# EAGLE schematic pm3-16 (EAGLE 7.4.0)

## Sheet 1 of 5
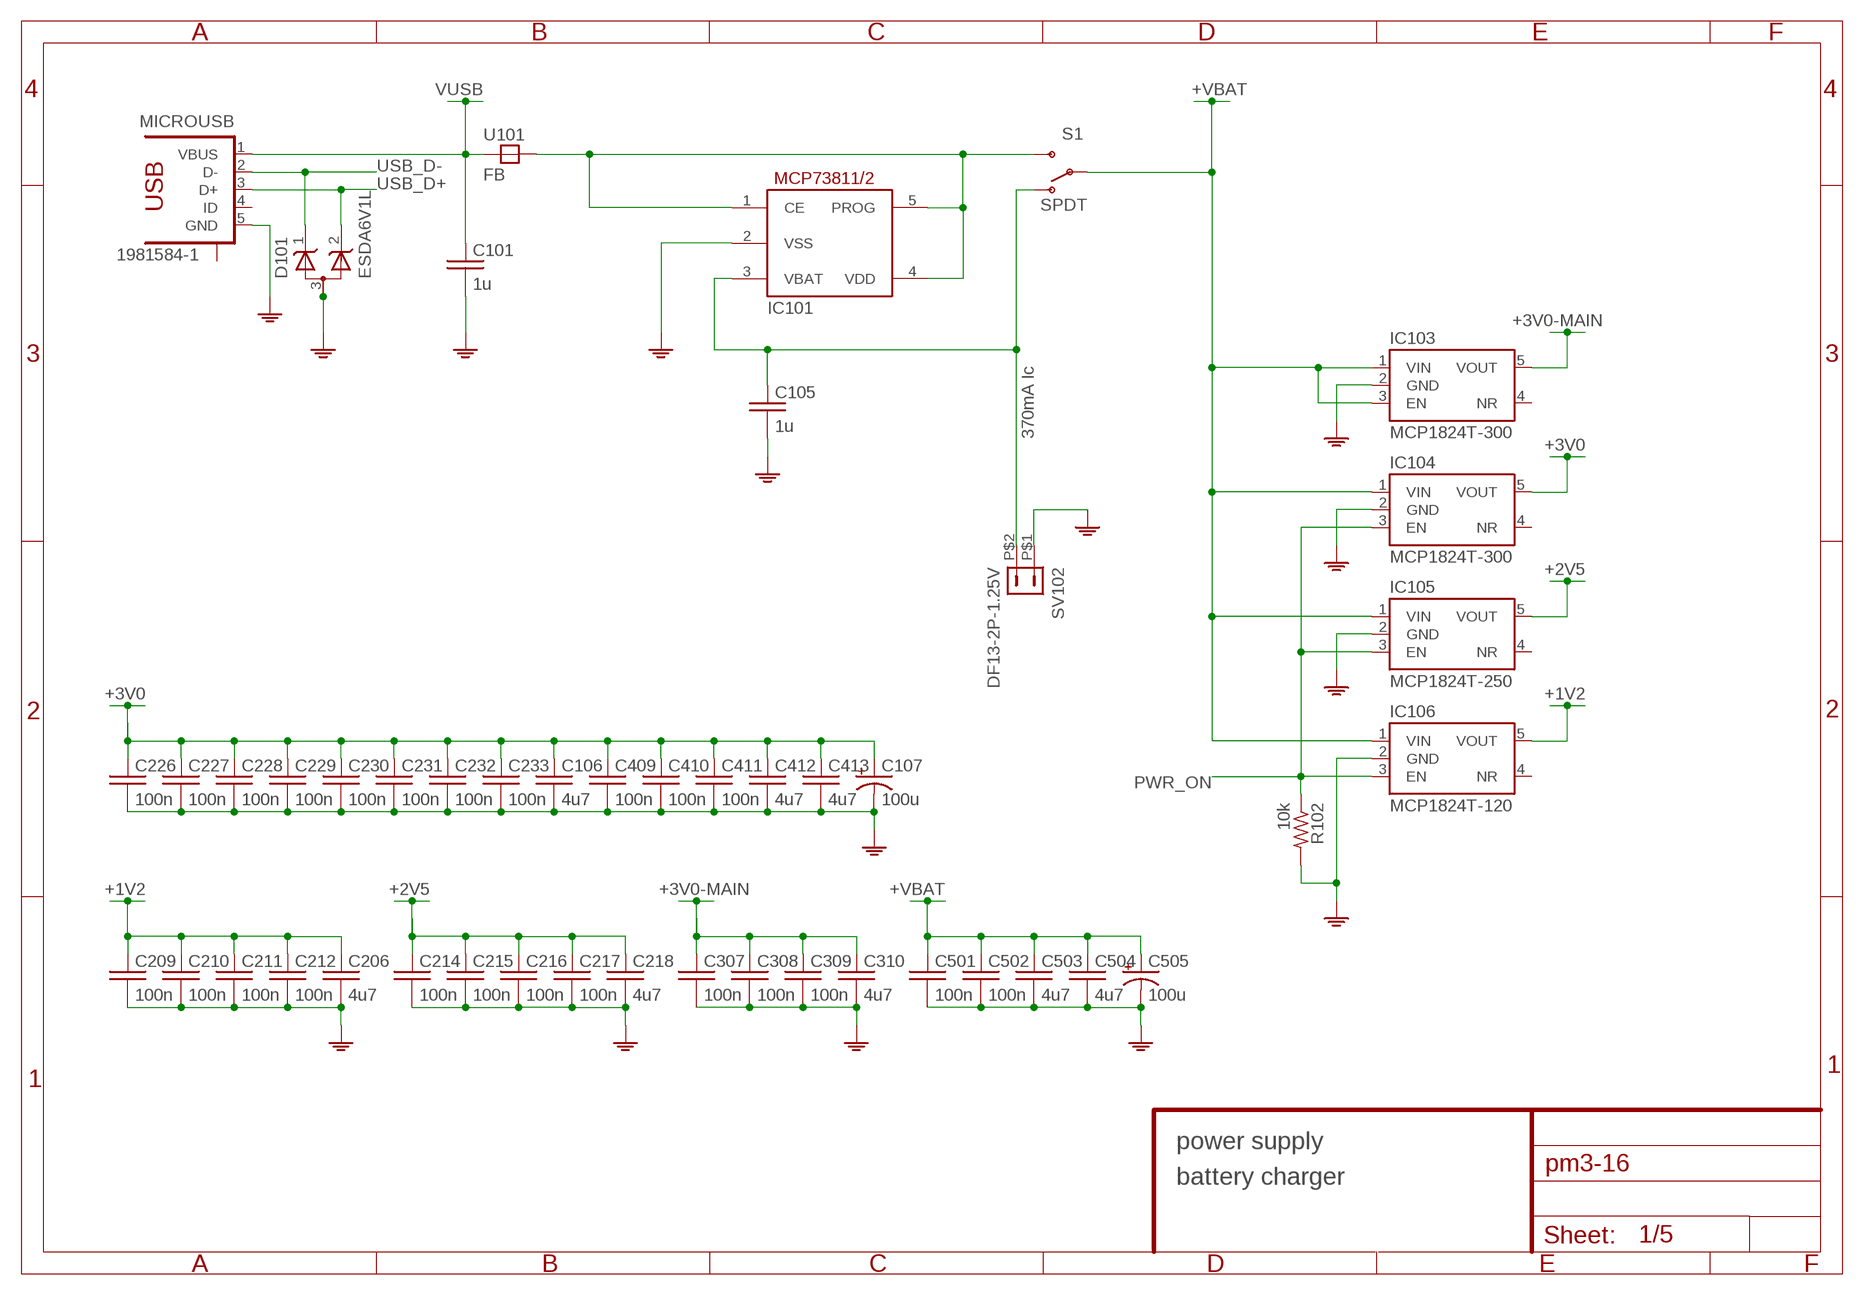
[diagram p0: schematic, sheet 1]

### Parts
C101  1u  C-EU  [0603]
C105  1u  C-EU  [0603]
C106  4u7  C-EU  [0603]
C107  100u  CPOL-US  [153CLV-0605]
C206  4u7  C-EU  [0603]
C209  100n  C-EU  [0603]
C210  100n  C-EU  [0603]
C211  100n  C-EU  [0603]
C212  100n  C-EU  [0603]
C214  100n  C-EU  [0603]
C215  100n  C-EU  [0603]
C216  100n  C-EU  [0603]
C217  100n  C-EU  [0603]
C218  4u7  C-EU  [0603]
C226  100n  C-EU  [0603]
C227  100n  C-EU  [0603]
C228  100n  C-EU  [0603]
C229  100n  C-EU  [0603]
C230  100n  C-EU  [0603]
C231  100n  C-EU  [0603]
C232  100n  C-EU  [0603]
C233  100n  C-EU  [0603]
C307  100n  C-EU  [0603]
C308  100n  C-EU  [0603]
C309  100n  C-EU  [0603]
C310  4u7  C-EU  [0603]
C409  100n  C-EU  [0603]
C410  100n  C-EU  [0603]
C411  100n  C-EU  [0603]
C412  4u7  C-EU  [0603]
C413  4u7  C-EU  [0603]
C501  100n  C-EU  [0603]
C502  100n  C-EU  [0603]
C503  4u7  C-EU  [0603]
C504  4u7  C-EU  [0603]
C505  100u  CPOL-US  [153CLV-0605]
D101  ESDA6V1L  [SOT-23-3]
IC101  MCP73811/2  [SOT23-5L]
IC103  MCP1824T-300  TPS79930  [SOT-23-5]
IC104  MCP1824T-300  TPS79930  [SOT-23-5]
IC105  MCP1824T-250  TPS79925  [SOT-23-5]
IC106  MCP1824T-120  TPS79912  [SOT-23-5]
MICROUSB  1981584-1  [1981584-1]
R102  10k  R-US  [0603]
S1  SPDT  SWITCH-SPSTSMD2  [SWITCH-SPDT-SMD]
SV102  DF13-2P-1.25V  [DF13C-2P-1.25V]
U101  FB  [0805]

### Nets
+1V2: C206.1 C209.1 C210.1 C211.1 C212.1 IC106.5(VOUT) ; also sheet 2
+2V5: C214.1 C215.1 C216.1 C217.1 C218.1 IC105.5(VOUT) ; also sheet 2
+3V0: C106.1 C107.+ C226.1 C227.1 C228.1 C229.1 C230.1 C231.1 C232.1 C233.1 C409.1 C410.1 C411.1 C412.1 C413.1 IC104.5(VOUT) ; also sheet 2,3,4
+3V0-MAIN: C307.1 C308.1 C309.1 C310.1 IC103.5(VOUT) ; also sheet 3
+VBAT: C501.1 C502.1 C503.1 C504.1 C505.+ IC103.1(VIN) IC103.3(EN) IC104.1(VIN) IC105.1(VIN) IC106.1(VIN) S1.2(P) ; also sheet 3,5
BAT: C105.1 IC101.3(VBAT) S1.1(O) SV102.P$2
GND: C101.2 C105.2 C106.2 C107.- C206.2 C209.2 C210.2 C211.2 C212.2 C214.2 C215.2 C216.2 C217.2 C218.2 C226.2 C227.2 C228.2 C229.2 C230.2 C231.2 C232.2 C233.2 C307.2 C308.2 C309.2 C310.2 C409.2 C410.2 C411.2 C412.2 C413.2 C501.2 C502.2 C503.2 C504.2 C505.- D101.3(AA) IC101.2(VSS) IC103.2(GND) IC104.2(GND) IC105.2(GND) IC106.2(GND) MICROUSB.5(GND) R102.2 SV102.P$1 ; supply symbol labelled AGND ; also sheet 2,3,4,5
N$18: IC101.1(CE) IC101.4(VDD) IC101.5(PROG) S1.3(S) U101.2(B)
PWR_ON: IC104.3(EN) IC105.3(EN) IC106.3(EN) R102.1 ; also sheet 3
USB_D+: D101.2(K2) MICROUSB.3(D+) ; also sheet 3
USB_D-: D101.1(K1) MICROUSB.2(D-) ; also sheet 3
VUSB: C101.1 MICROUSB.1(VBUS) U101.1(A)
Unconnected: IC103.4(NR) IC104.4(NR) IC105.4(NR) IC106.4(NR) MICROUSB.4(ID) MICROUSB.S1 MICROUSB.S2 MICROUSB.S3 MICROUSB.S4

### Notes on the sheet
- 370mA Ic
- power supply
- battery charger

## Sheet 2 of 5
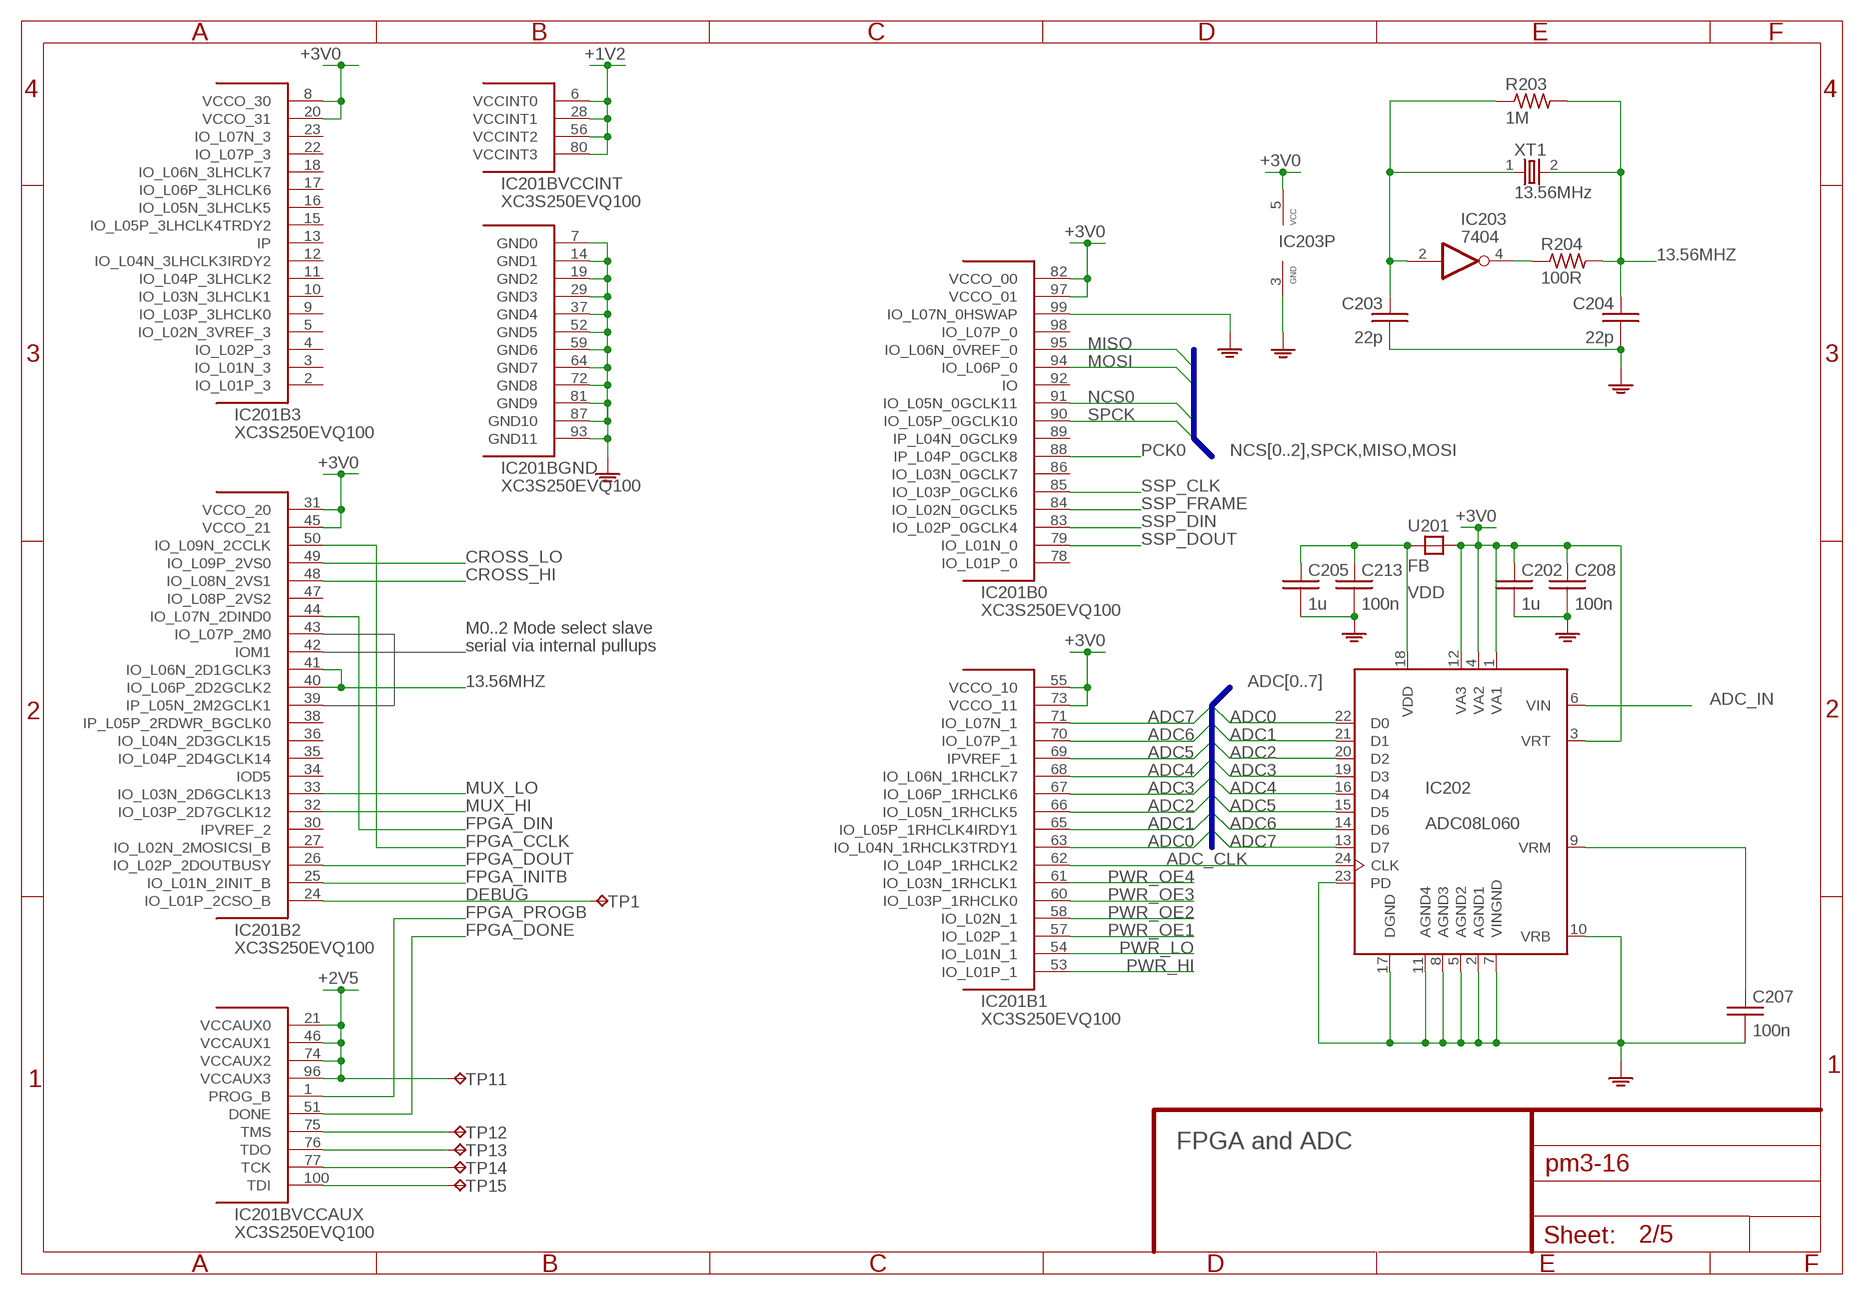
[diagram p1: schematic, sheet 2]

### Parts
C202  1u  C-EU  [0603]
C203  22p  C-EU  [0603]
C204  22p  C-EU  [0603]
C205  1u  C-EU  [0603]
C207  100n  C-EU  [0603]
C208  100n  C-EU  [0603]
C213  100n  C-EU  [0603]
IC201  XC3S250EVQ100  [VQ100]
IC202  ADC08L060  ADC08060  [TSSOP24]
IC203  7404  [SOT-23-5]
R203  1M  R-US  [0603]
R204  100R  R-US  [0603]
TP1  TPTP06SQ  [TP06SQ]
TP11  TPTP06SQ  [TP06SQ]
TP12  TPTP06SQ  [TP06SQ]
TP13  TPTP06SQ  [TP06SQ]
TP14  TPTP06SQ  [TP06SQ]
TP15  TPTP06SQ  [TP06SQ]
U201  FB  [0805]
XT1  13.56MHz  XTAL  [6035]

### Nets
13.56MHZ: C204.1 IC201.40(B2:IO_L06P_2D2GCLK2) IC201.41(B2:IO_L06N_2D1GCLK3) R203.2 R204.2 XT1.2(G$2)
+1V2: IC201.6(BVCCINT:VCCINT0) IC201.28(BVCCINT:VCCINT1) IC201.56(BVCCINT:VCCINT2) IC201.80(BVCCINT:VCCINT3) ; also sheet 1
+2V5: IC201.21(BVCCAUX:VCCAUX0) IC201.46(BVCCAUX:VCCAUX1) IC201.74(BVCCAUX:VCCAUX2) IC201.96(BVCCAUX:VCCAUX3) TP11.TP ; also sheet 1
+3V0: C202.1 C208.1 IC201.8(B3:VCCO_30) IC201.20(B3:VCCO_31) IC201.31(B2:VCCO_20) IC201.45(B2:VCCO_21) IC201.55(B1:VCCO_10) IC201.73(B1:VCCO_11) IC201.82(B0:VCCO_00) IC201.97(B0:VCCO_01) IC202.1(VA1) IC202.3(VRT) IC202.4(VA2) IC202.12(VA3) IC203.5(VCC) U201.2(B) ; also sheet 1,3,4
ADC0: IC201.63(B1:IO_L04N_1RHCLK3TRDY1) IC202.22(D0)
ADC1: IC201.65(B1:IO_L05P_1RHCLK4IRDY1) IC202.21(D1)
ADC2: IC201.66(B1:IO_L05N_1RHCLK5) IC202.20(D2)
ADC3: IC201.67(B1:IO_L06P_1RHCLK6) IC202.19(D3)
ADC4: IC201.68(B1:IO_L06N_1RHCLK7) IC202.16(D4)
ADC5: IC201.69(B1:IPVREF_1) IC202.15(D5)
ADC6: IC201.70(B1:IO_L07P_1) IC202.14(D6)
ADC7: IC201.71(B1:IO_L07N_1) IC202.13(D7)
ADC_CLK: IC201.62(B1:IO_L04P_1RHCLK2) IC202.24(CLK)
ADC_IN: IC202.6(VIN) ; also sheet 4
CROSS_HI: IC201.48(B2:IO_L08N_2VS1) ; also sheet 4
CROSS_LO: IC201.49(B2:IO_L09P_2VS0) ; also sheet 4
DEBUG: IC201.24(B2:IO_L01P_2CSO_B) TP1.TP
FPGA_CCLK: IC201.50(B2:IO_L09N_2CCLK) ; also sheet 3
FPGA_DIN: IC201.44(B2:IO_L07N_2DIND0) ; also sheet 3
FPGA_DONE: IC201.51(BVCCAUX:DONE) ; also sheet 3
FPGA_DOUT: IC201.26(B2:IO_L02P_2DOUTBUSY) ; also sheet 3
FPGA_INITB: IC201.25(B2:IO_L01N_2INIT_B) ; also sheet 3
FPGA_PROGB: IC201.1(BVCCAUX:PROG_B) ; also sheet 3
FPGA_TCK: IC201.77(BVCCAUX:TCK) TP14.TP
FPGA_TDI: IC201.100(BVCCAUX:TDI) TP15.TP
FPGA_TDO: IC201.76(BVCCAUX:TDO) TP13.TP
FPGA_TMS: IC201.75(BVCCAUX:TMS) TP12.TP
GND: C202.2 C203.2 C204.2 C205.2 C207.2 C208.2 C213.2 IC201.7(BGND:GND0) IC201.14(BGND:GND1) IC201.19(BGND:GND2) IC201.29(BGND:GND3) IC201.37(BGND:GND4) IC201.52(BGND:GND5) IC201.59(BGND:GND6) IC201.64(BGND:GND7) IC201.72(BGND:GND8) IC201.81(BGND:GND9) IC201.87(BGND:GND10) IC201.93(BGND:GND11) IC201.99(B0:IO_L07N_0HSWAP) IC202.2(AGND1) IC202.5(AGND2) IC202.7(VINGND) IC202.8(AGND3) IC202.10(VRB) IC202.11(AGND4) IC202.17(DGND) IC202.23(PD) IC203.3(GND) ; supply symbol labelled AGND ; also sheet 1,3,4,5
MISO: IC201.95(B0:IO_L06N_0VREF_0) ; also sheet 3
MOSI: IC201.94(B0:IO_L06P_0) ; also sheet 3
MUX_HI: IC201.32(B2:IO_L03P_2D7GCLK12) ; also sheet 4
MUX_LO: IC201.33(B2:IO_L03N_2D6GCLK13) ; also sheet 4
N$1: C207.1 IC202.9(VRM)
N$3: IC203.4(O) R204.1
N$4: C203.1 IC203.2(I) R203.1 XT1.1(G$1)
NCS0: IC201.91(B0:IO_L05N_0GCLK11) ; also sheet 3
PCK0: IC201.88(B0:IP_L04P_0GCLK8) ; also sheet 3
PWR_HI: IC201.53(B1:IO_L01P_1) ; also sheet 5
PWR_LO: IC201.54(B1:IO_L01N_1) ; also sheet 5
PWR_OE1: IC201.57(B1:IO_L02P_1) ; also sheet 5
PWR_OE2: IC201.58(B1:IO_L02N_1) ; also sheet 5
PWR_OE3: IC201.60(B1:IO_L03P_1RHCLK0) ; also sheet 5
PWR_OE4: IC201.61(B1:IO_L03N_1RHCLK1) ; also sheet 5
SPCK: IC201.90(B0:IO_L05P_0GCLK10) ; also sheet 3
SSP_CLK: IC201.85(B0:IO_L03P_0GCLK6) ; also sheet 3
SSP_DIN: IC201.83(B0:IO_L02P_0GCLK4) ; also sheet 3
SSP_DOUT: IC201.79(B0:IO_L01N_0) ; also sheet 3
SSP_FRAME: IC201.84(B0:IO_L02N_0GCLK5) ; also sheet 3
VDD: C205.1 C213.1 IC202.18(VDD) U201.1(A)
Unconnected: IC201.2(B3:IO_L01P_3) IC201.3(B3:IO_L01N_3) IC201.4(B3:IO_L02P_3) IC201.5(B3:IO_L02N_3VREF_3) IC201.9(B3:IO_L03P_3LHCLK0) IC201.10(B3:IO_L03N_3LHCLK1) IC201.11(B3:IO_L04P_3LHCLK2) IC201.12(B3:IO_L04N_3LHCLK3IRDY2) IC201.13(B3:IP) IC201.15(B3:IO_L05P_3LHCLK4TRDY2) IC201.16(B3:IO_L05N_3LHCLK5) IC201.17(B3:IO_L06P_3LHCLK6) IC201.18(B3:IO_L06N_3LHCLK7) IC201.22(B3:IO_L07P_3) IC201.23(B3:IO_L07N_3) IC201.27(B2:IO_L02N_2MOSICSI_B) IC201.30(B2:IPVREF_2) IC201.34(B2:IOD5) IC201.35(B2:IO_L04P_2D4GCLK14) IC201.36(B2:IO_L04N_2D3GCLK15) IC201.38(B2:IP_L05P_2RDWR_BGCLK0) IC201.39(B2:IP_L05N_2M2GCLK1) IC201.42(B2:IOM1) IC201.43(B2:IO_L07P_2M0) IC201.47(B2:IO_L08P_2VS2) IC201.78(B0:IO_L01P_0) IC201.86(B0:IO_L03N_0GCLK7) IC201.89(B0:IP_L04N_0GCLK9) IC201.92(B0:IO) IC201.98(B0:IO_L07P_0)

### Buses
NCS[0..2],SPCK,MISO,MOSI
ADC[0..7]

### Notes on the sheet
- M0..2 Mode select slave
- serial via internal pullups
- FPGA and ADC

## Sheet 3 of 5
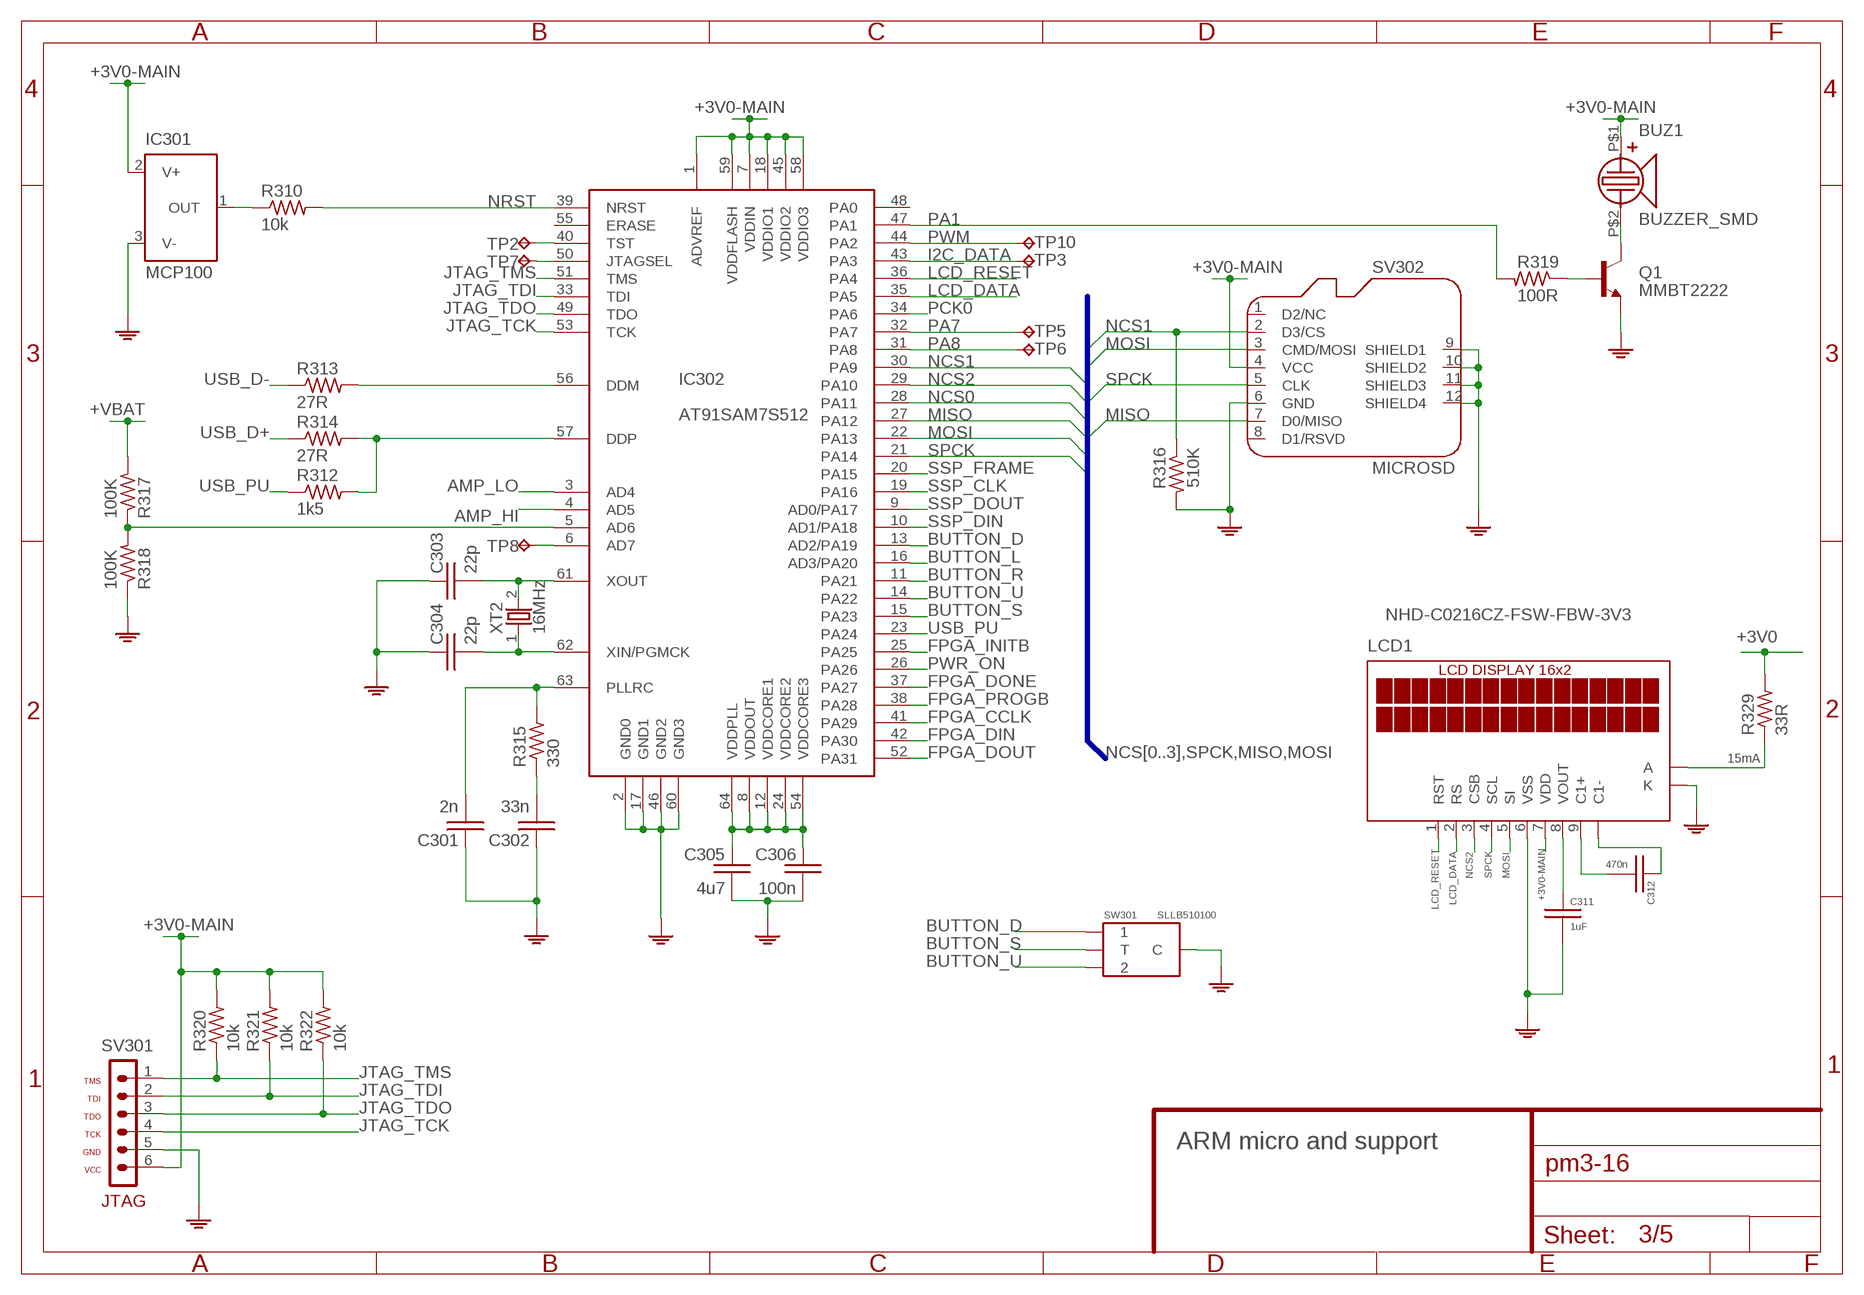
[diagram p2: schematic, sheet 3]

### Parts
BUZ1  BUZZER_SMD  [BUZZER_SMD]
C301  2n  C-EU  [0603]
C302  33n  C-EU  [0603]
C303  22p  C-EU  [0603]
C304  22p  C-EU  [0603]
C305  4u7  C-EU  [0603]
C306  100n  C-EU  [0603]
C311  1uF  C-EU  [0603]
C312  470n  C-EU  [0603]
IC301  MCP100  [SOT-23-3]
IC302  AT91SAM7S512  [LQFP64]
LCD1  NHD-C0216CZ-FSW-FBW-3V3  [NHD-C0216CZ-FSW-FBW-3V3]
Q1  MMBT2222  TRANSISTOR_NPNSOT23  [SOT-23-3]
R310  10k  R-US  [0603]
R312  1k5  R-US  [0603]
R313  27R  R-US  [0603]
R314  27R  R-US  [0603]
R315  330  R-US  [0603]
R316  510K  R-US  [0603]
R317  100K  R-US  [0603]
R318  100K  R-US  [0603]
R319  100R  R-US  [0603]
R320  10k  R-US  [0603]
R321  10k  R-US  [0603]
R322  10k  R-US  [0603]
R329  33R  R-US  [0603]
SV301  HEADER-1X6  [HEADER-1X6]
SV302  MICROSD  [3M-MICROSD]
SW301  SLLB510100  [SLLB510100]
TP2  TPTP06SQ  [TP06SQ]
TP3  TPTP06SQ  [TP06SQ]
TP5  TPTP06SQ  [TP06SQ]
TP6  TPTP06SQ  [TP06SQ]
TP7  TPTP06SQ  [TP06SQ]
TP8  TPTP06SQ  [TP06SQ]
TP10  TPTP06SQ  [TP06SQ]
XT2  16MHz  XTAL  [6035]

### Nets
+3V0: R329.2 ; also sheet 1,2,4
+3V0-MAIN: BUZ1.P$1 IC301.2(V+) IC302.1(ADVREF) IC302.7(VDDIN) IC302.18(VDDIO1) IC302.45(VDDIO2) IC302.58(VDDIO3) IC302.59(VDDFLASH) LCD1.7(VDD) R320.2 R321.2 R322.2 SV301.6 SV302.4(VCC) ; also sheet 1
+VBAT: R317.2 ; also sheet 1,5
AD6: IC302.5(AD6) R317.1 R318.2
AD7: IC302.6(AD7) TP8.TP
AMP_HI: IC302.4(AD5) ; also sheet 4
AMP_LO: IC302.3(AD4) ; also sheet 4
BUTTON_D: IC302.13(AD2/PA19) SW301.1
BUTTON_L: IC302.16(AD3/PA20)
BUTTON_R: IC302.11(PA21)
BUTTON_S: IC302.15(PA23) SW301.T
BUTTON_U: IC302.14(PA22) SW301.2
FPGA_CCLK: IC302.41(PA29) ; also sheet 2
FPGA_DIN: IC302.42(PA30) ; also sheet 2
FPGA_DONE: IC302.37(PA27) ; also sheet 2
FPGA_DOUT: IC302.52(PA31) ; also sheet 2
FPGA_INITB: IC302.25(PA25) ; also sheet 2
FPGA_PROGB: IC302.38(PA28) ; also sheet 2
GND: C301.1 C302.1 C303.1 C304.1 C305.2 C306.2 C311.2 IC301.3(V-) IC302.2(GND0) IC302.17(GND1) IC302.46(GND2) IC302.60(GND3) LCD1.6(VSS) LCD1.K Q1.2(E) R316.2 R318.1 SV301.5 SV302.6(GND) SV302.9(SHIELD1) SV302.10(SHIELD2) SV302.11(SHIELD3) SV302.12(SHIELD4) SW301.C ; supply symbol labelled AGND ; also sheet 1,2,4,5
I2C_DATA: IC302.43(PA3) TP3.TP
JTAG_TCK: IC302.53(TCK) SV301.4
JTAG_TDI: IC302.33(TDI) R321.1 SV301.2
JTAG_TDO: IC302.49(TDO) R322.1 SV301.3
JTAG_TMS: IC302.51(TMS) R320.1 SV301.1
LCD_DATA: IC302.35(PA5) LCD1.2(RS)
LCD_RESET: IC302.36(PA4) LCD1.1(RST)
MISO: IC302.27(PA12) SV302.7(D0/MISO) ; also sheet 2
MOSI: IC302.22(PA13) LCD1.5(SI) SV302.3(CMD/MOSI) ; also sheet 2
N$2: C301.2 IC302.63(PLLRC) R315.2
N$6: C302.2 R315.1
N$7: C303.2 IC302.61(XOUT) XT2.2(G$2)
N$8: C304.2 IC302.62(XIN/PGMCK) XT2.1(G$1)
N$9: LCD1.A R329.1
N$10: IC302.40(TST) TP2.TP
N$11: IC302.56(DDM) R313.2
N$12: IC302.57(DDP) R312.2 R314.2
N$13: IC301.1(OUT) R310.1
N$21: BUZ1.P$2 Q1.3(C)
N$31: Q1.1(B) R319.1
N$36: C305.1 C306.1 IC302.8(VDDOUT) IC302.12(VDDCORE1) IC302.24(VDDCORE2) IC302.54(VDDCORE3) IC302.64(VDDPLL)
N$38: IC302.50(JTAGSEL) TP7.TP
N$57: C311.1 LCD1.8(VOUT)
N$58: C312.2 LCD1.9(C1+)
N$59: C312.1 LCD1.10(C1-)
NCS0: IC302.28(PA11) ; also sheet 2
NCS1: IC302.30(PA9) R316.1 SV302.2(D3/CS)
NCS2: IC302.29(PA10) LCD1.3(CSB)
NRST: IC302.39(NRST) R310.2
PA1: IC302.47(PA1) R319.2
PA7: IC302.32(PA7) TP5.TP
PA8: IC302.31(PA8) TP6.TP
PCK0: IC302.34(PA6) ; also sheet 2
PWM: IC302.44(PA2) TP10.TP
PWR_ON: IC302.26(PA26) ; also sheet 1
SPCK: IC302.21(PA14) LCD1.4(SCL) SV302.5(CLK) ; also sheet 2
SSP_CLK: IC302.19(PA16) ; also sheet 2
SSP_DIN: IC302.10(AD1/PA18) ; also sheet 2
SSP_DOUT: IC302.9(AD0/PA17) ; also sheet 2
SSP_FRAME: IC302.20(PA15) ; also sheet 2
USB_D+: R314.1 ; also sheet 1
USB_D-: R313.1 ; also sheet 1
USB_PU: IC302.23(PA24) R312.1
Unconnected: IC302.48(PA0) IC302.55(ERASE) SV302.1(D2/NC) SV302.8(D1/RSVD)

### Buses
NCS[0..3],SPCK,MISO,MOSI

### Notes on the sheet
- 15mA
- ARM micro and support

## Sheet 4 of 5
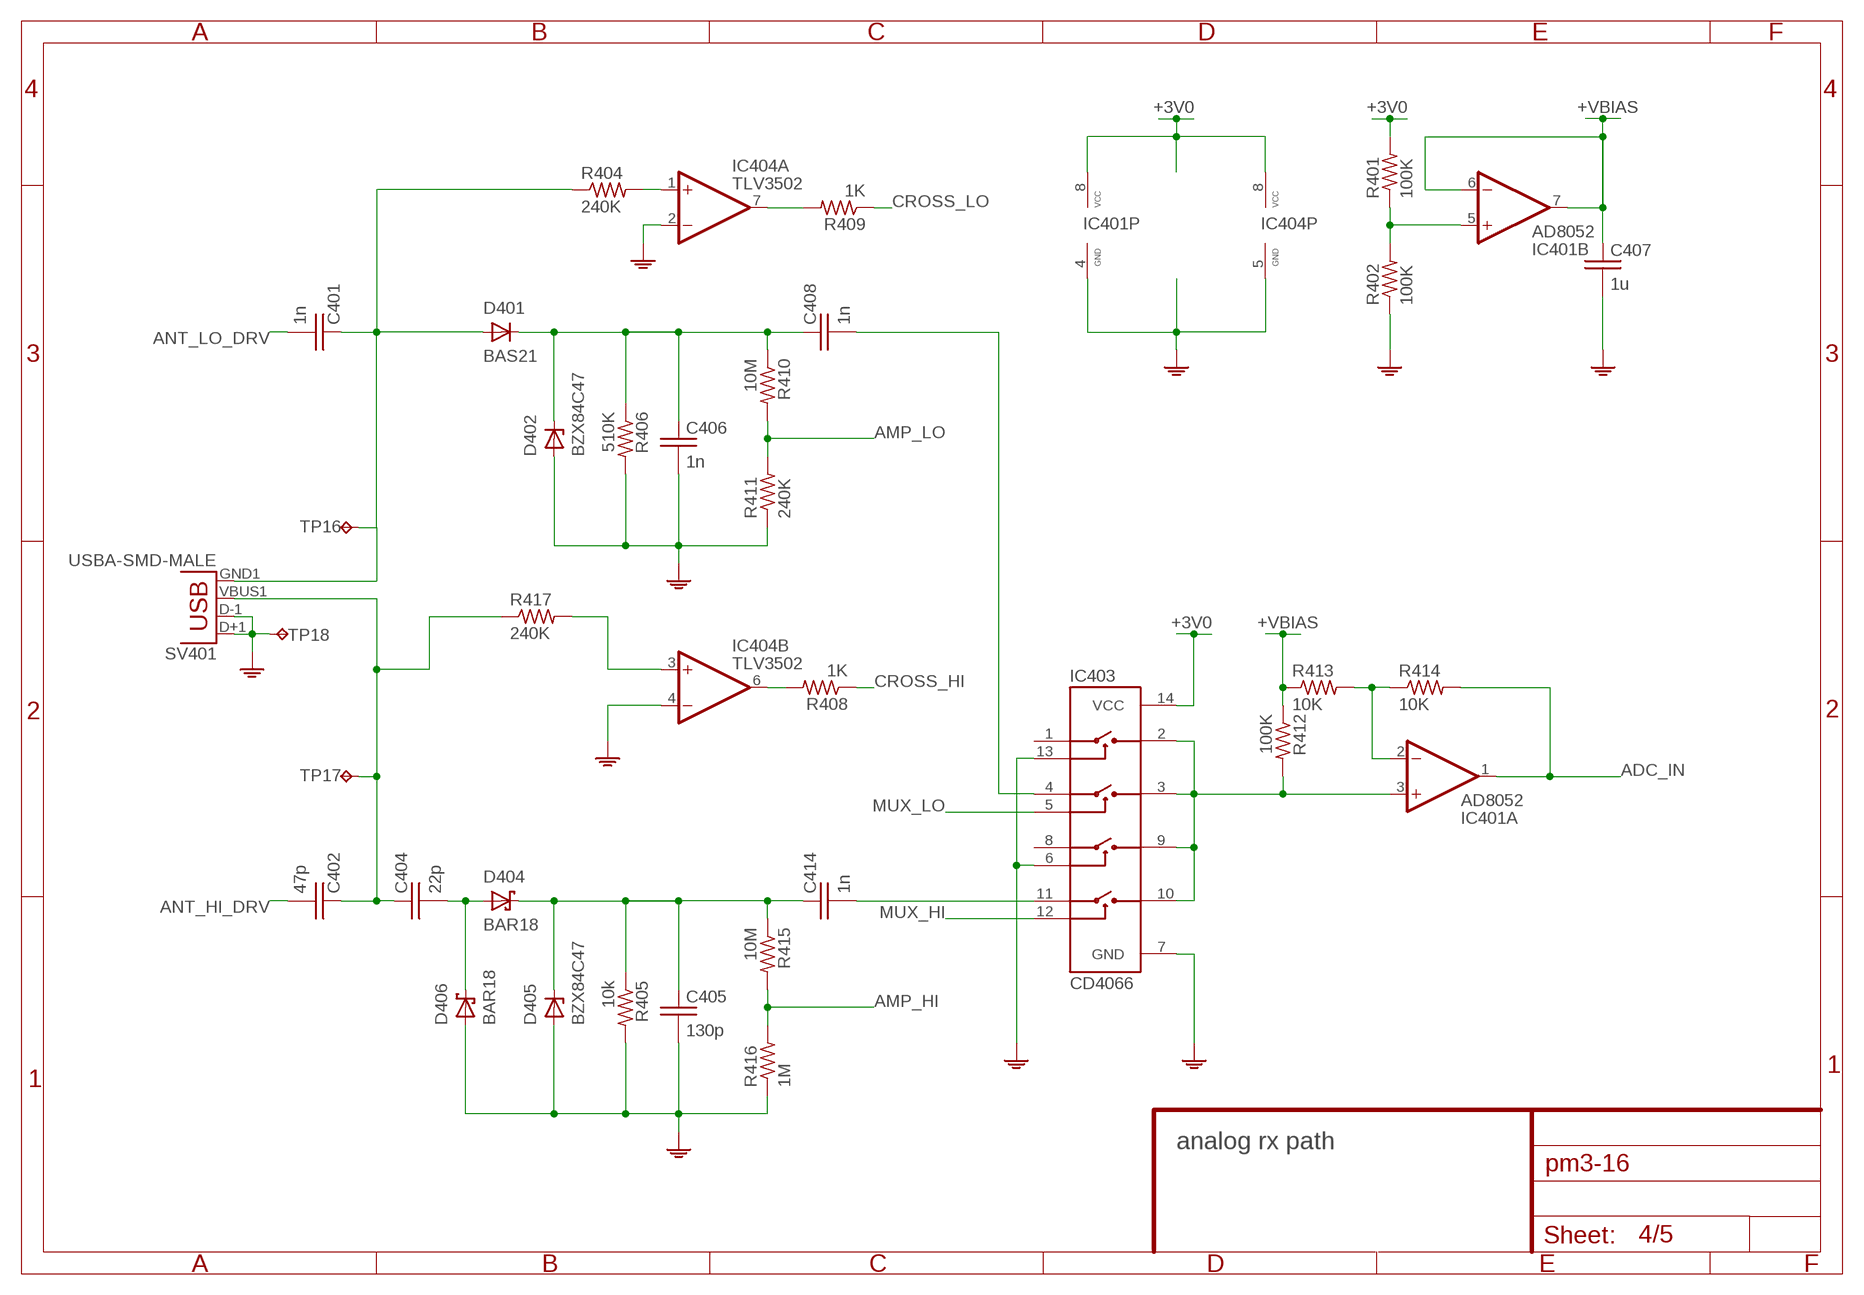
[diagram p3: schematic, sheet 4]

### Parts
C401  1n  C-EU  [0603]
C402  47p  C-EU  [0603]
C404  22p  C-EU  [0603]
C405  130p  C-EU  [0603]
C406  1n  C-EU  [0603]
C407  1u  C-EU  [0603]
C408  1n  C-EU  [0603]
C414  1n  C-EU  [0603]
D401  BAS21  [SOT-23-3]
D402  BZX84C47  [SOT-23-3]
D404  BAR18  [SOT-23-3]
D405  BZX84C47  [SOT-23-3]
D406  BAR18  [SOT-23-3]
IC401  AD8052  [MSOP8]
IC403  CD4066  [TSSOP14]
IC404  TLV3502  TLV3502SOT23-8  [SOT-23-8]
R401  100K  R-US  [0603]
R402  100K  R-US  [0603]
R404  240K  R-US  [0603]
R405  10k  R-US  [0603]
R406  510K  R-US  [0603]
R408  1K  R-US  [0603]
R409  1K  R-US  [0603]
R410  10M  R-US  [0603]
R411  240K  R-US  [0603]
R412  100K  R-US  [0603]
R413  10K  R-US  [0603]
R414  10K  R-US  [0603]
R415  10M  R-US  [0603]
R416  1M  R-US  [0603]
R417  240K  R-US  [0603]
SV401  USBA-SMD-MALE  [USB-A-SMT-MALE]
TP16  TPTP06SQ  [TP06SQ]
TP17  TPTP06SQ  [TP06SQ]
TP18  TPTP06SQ  [TP06SQ]

### Nets
+3V0: IC401.8(P:VCC) IC403.14(VCC) IC404.8(P:VCC) R401.2 ; also sheet 1,2,3
+VBIAS: C407.1 IC401.6(B:-IN) IC401.7(B:OUT) R412.1 R413.1
ADC_IN: IC401.1(A:OUT) R414.2 ; also sheet 2
ADCDR_HI: C405.1 C414.1 D404.3(C) D405.3(C) R405.1 R415.1
ADCDR_LO: C406.1 C408.1 D401.3(C) D402.3(C) R406.1 R410.1
AMP_HI: R415.2 R416.2 ; also sheet 3
AMP_LO: R410.2 R411.2 ; also sheet 3
ANT_HI_DRV: C402.2 ; also sheet 5
ANT_LO_DRV: C401.2 ; also sheet 5
CROSS_HI: R408.1 ; also sheet 2
CROSS_LO: R409.1 ; also sheet 2
GND: C405.2 C406.2 C407.2 D402.1(A) D405.1(A) D406.1(A) IC401.4(P:GND) IC403.6(C3) IC403.7(GND) IC403.13(C1) IC404.2(A:-IN) IC404.4(B:-IN) IC404.5(P:GND) R402.1 R405.2 R406.2 R411.1 R416.1 SV401.D+1(D+) SV401.D-1(D-) TP18.TP ; supply symbol labelled AGND ; also sheet 1,2,3,5
MUX_HI: IC403.12(C4) ; also sheet 2
MUX_LO: IC403.5(C2) ; also sheet 2
N$14: IC401.5(B:+IN) R401.1 R402.2
N$16: C414.2 IC403.11(A4)
N$17: C401.1 D401.1(A) R404.1 SV401.GND1(GND) TP16.TP
N$20: C404.2 D404.1(A) D406.3(C)
N$23: IC404.1(A:+IN) R404.2
N$24: IC404.7(A:OUT) R409.2
N$25: IC401.3(A:+IN) IC403.2(B1) IC403.3(B2) IC403.9(B3) IC403.10(B4) R412.2
N$28: IC404.6(B:OUT) R408.2
N$29: IC404.3(B:+IN) R417.2
N$32: C408.2 IC403.4(A2)
N$43: C402.1 C404.1 R417.1 SV401.VBUS1(VBUS) TP17.TP
N$52: IC401.2(A:-IN) R413.2 R414.1
Unconnected: IC403.1(A1) IC403.8(A3)

### Notes on the sheet
- analog rx path

## Sheet 5 of 5
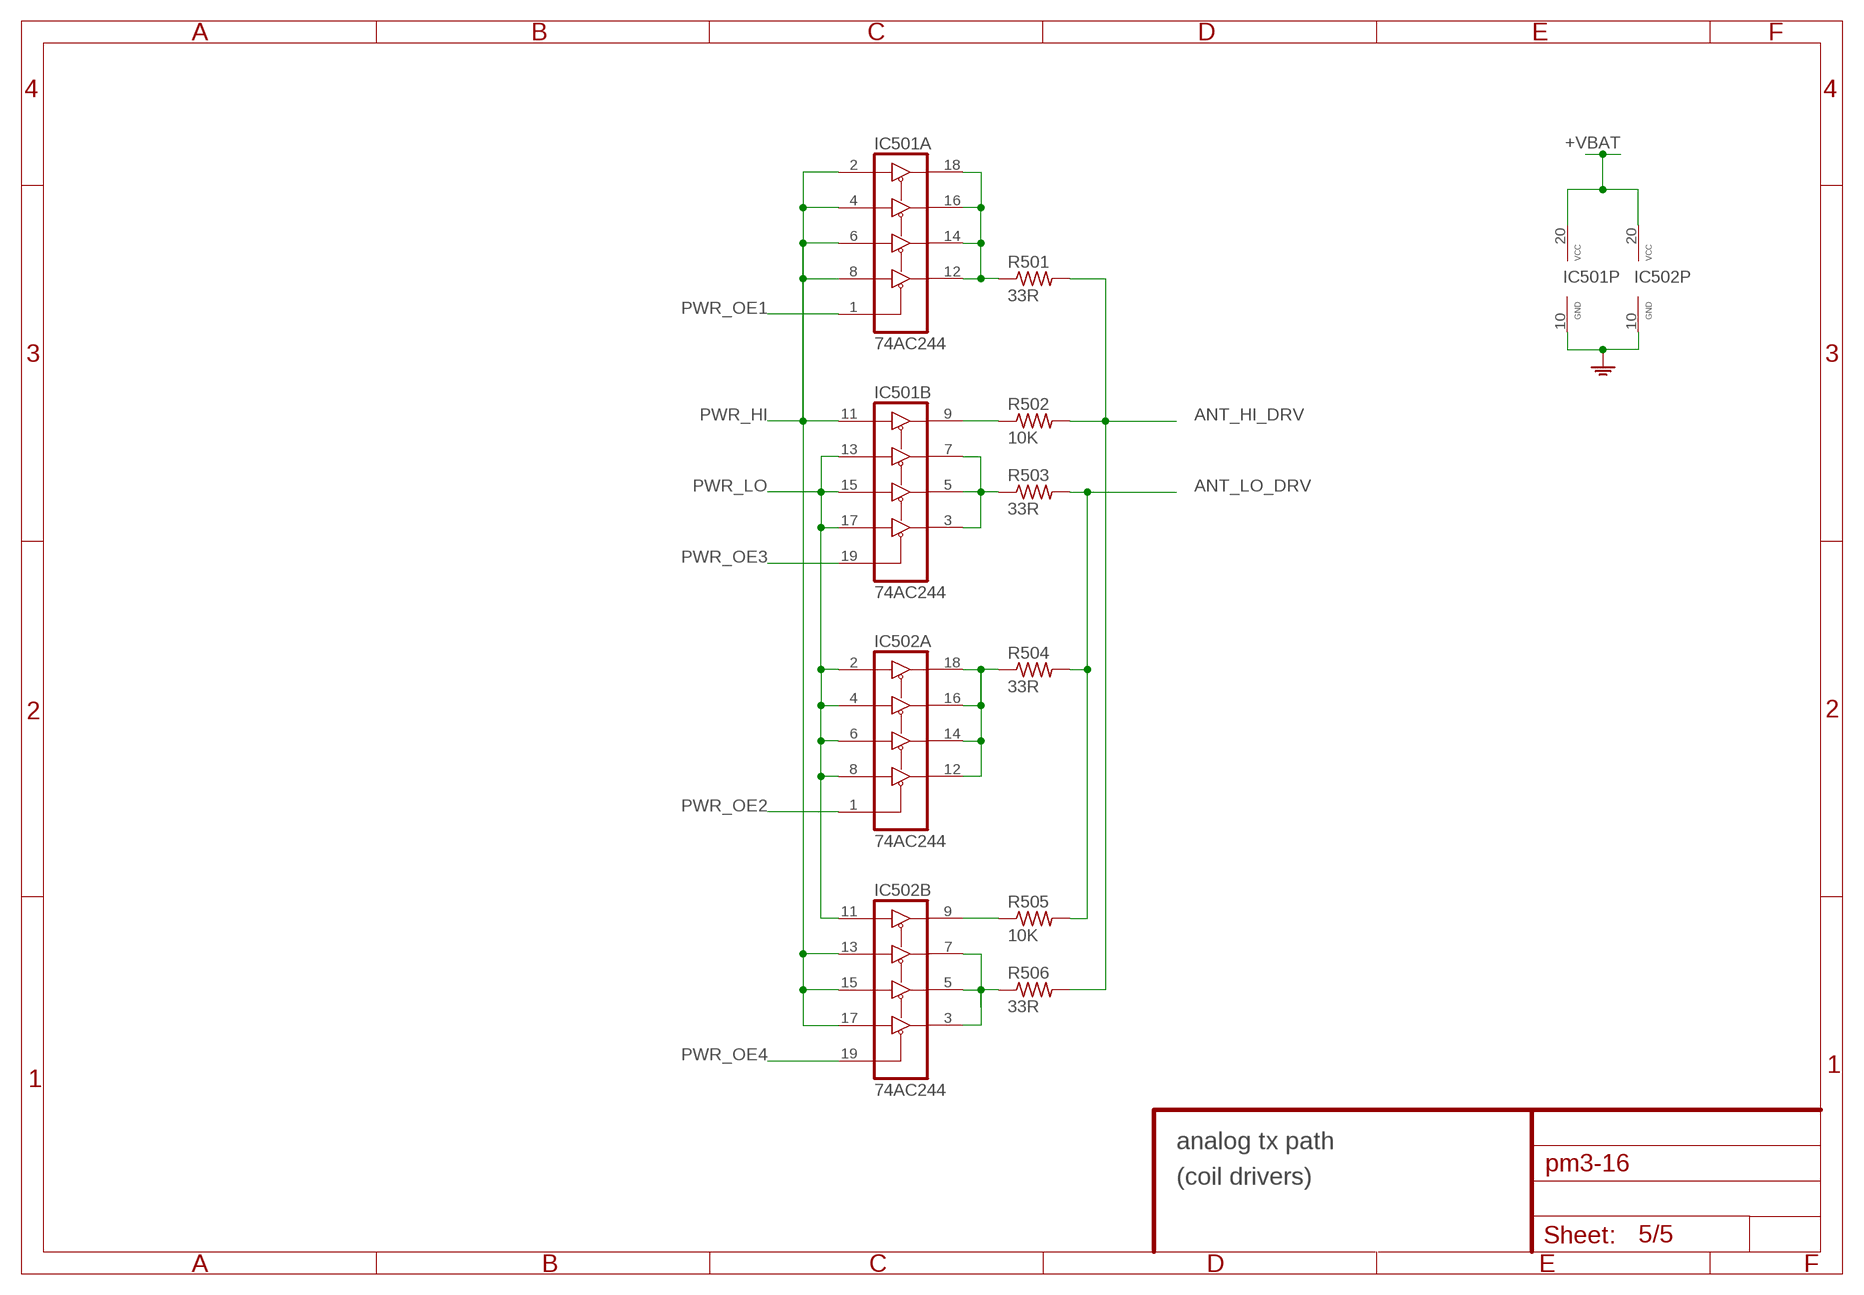
[diagram p4: schematic, sheet 5]

### Parts
IC501  74AC244  [TSSOP20]
IC502  74AC244  [TSSOP20]
R501  33R  R-US  [0603]
R502  10K  R-US  [0603]
R503  33R  R-US  [0603]
R504  33R  R-US  [0603]
R505  10K  R-US  [0603]
R506  33R  R-US  [0603]

### Nets
+VBAT: IC501.20(P:VCC) IC502.20(P:VCC) ; also sheet 1,3
ANT_HI_DRV: R501.2 R502.2 R506.2 ; also sheet 4
ANT_LO_DRV: R503.2 R504.2 R505.2 ; also sheet 4
GND: IC501.10(P:GND) IC502.10(P:GND) ; supply symbol labelled AGND ; also sheet 1,2,3,4
N$33: IC501.12(A:Y4) IC501.14(A:Y3) IC501.16(A:Y2) IC501.18(A:Y1) R501.1
N$34: IC502.12(A:Y4) IC502.14(A:Y3) IC502.16(A:Y2) IC502.18(A:Y1) R504.1
N$41: IC501.3(B:Y4) IC501.5(B:Y3) IC501.7(B:Y2) R503.1
N$42: IC502.3(B:Y4) IC502.5(B:Y3) IC502.7(B:Y2) R506.1
N$44: IC501.9(B:Y1) R502.1
N$45: IC502.9(B:Y1) R505.1
PWR_HI: IC501.2(A:A1) IC501.4(A:A2) IC501.6(A:A3) IC501.8(A:A4) IC501.11(B:A1) IC502.13(B:A2) IC502.15(B:A3) IC502.17(B:A4) ; also sheet 2
PWR_LO: IC501.13(B:A2) IC501.15(B:A3) IC501.17(B:A4) IC502.2(A:A1) IC502.4(A:A2) IC502.6(A:A3) IC502.8(A:A4) IC502.11(B:A1) ; also sheet 2
PWR_OE1: IC501.1(A:G) ; also sheet 2
PWR_OE2: IC502.1(A:G) ; also sheet 2
PWR_OE3: IC501.19(B:G) ; also sheet 2
PWR_OE4: IC502.19(B:G) ; also sheet 2

### Notes on the sheet
- analog tx path
- (coil drivers)

## Library data of the parts
BUZ1 = proxmark:BUZZER_SMD
C101 C105 C106 C202-C218 C226-C233 C301-C312 C401 C402 C404-C414 C501-C504 = proxmark:C-EU: CERAMIC CHIP CAPACITOR
C107 C505 = proxmark:CPOL-US: POLARIZED ELECTROLYTIC CAPACITOR
D101 = proxmark:ESDA6V1L: ESD PROTECTION Digikey part: ESDA6V1L-TPCT-ND
D401 = proxmark:BAS21: BAS21 fast switching diode Digikey part: BAS21INCT-ND
D402 D405 = proxmark:BZX84C*: ZENNER CHIP DIODE Digikey part: BZX84C47LT1GOSCT-ND
D404 D406 = proxmark:BAR18: SMALL SIGNAL SCHOTTKY DIODE Digikey part: 497-2529-1-ND
IC101 = adafruit:MCP73811/2: MCP73811 and MCP73812 Simple, Miniature Single-Cell, Fully Integrated Li-Ion / Li-Polymer Charge Management Controllers SOT-23-5 package, no indicator LED but with adjustable current, small and very inexpensive
IC103-IC106 = proxmark:TPS799*: IC LDO REG 200mA Digikey part: 296-17782-1-ND
IC201 = proxmark:XC3S*EVQ100: Xilinx FPGA
IC202 = proxmark:ADC08060: 8BIT A/D CONVERTER, 60MHZ Digikey part: ADC08060CIMTXCT-ND
IC203 = proxmark:74*04: Single CMOS inverter gate Digikey part: TC7SU04FFCT-ND
IC301 = proxmark:MCP100: MICRO SUPERVISOR Digikey part: MCP100T-300I/TTCT-ND
IC302 = proxmark:AT91SAM7S*: AT91SAM7 ARM MICRO Digikey part: AT91SAM7S256AU001-ND
IC401 = proxmark:AD8052: Rail-to-rail Op-Amp Digikey part: AD8052ARMZ-ND
IC403 = proxmark:CD4066: 4-CH MUX 1.8/5.5V Digikey part: 296-14123-1-ND
IC404 = proxmark:TLV3502
IC501 IC502 = proxmark:74*244: Octal BUFFER and LINE DRIVER 3-state
LCD1 = NHD-C0216CZ-FSW-FBW-3V3:NHD-C0216CZ-FSW-FBW-3V3
MICROUSB = con-usb:1981584-1: Receptacle, micro-USB, type A/B Tyco Electronics
Q1 = proxmark:TRANSISTOR_NPN: Transistor NPN BJT configuration in SOT23 package. MMBT2222 is the common NPN we use. Double check BCE configuration again layout.
R102 R203 R204 R310 R312-R322 R329 R401 R402 R404-R406 R408-R417 R501-R506 = proxmark:R-US: CHIP RESISTOR
S1 = proxmark:SWITCH-SPST: SPST Switch Simple slide switch. Spark Fun Electronics SKU : COM-00102
SV102 = con-hirose-df13:DF13-2P-1.25: DF13-2P 1.25mm Pitch Miniature Crimping Connector.
SV301 = proxmark:HEADER-1X6: JTAG Header
SV302 = proxmark:MICROSD: CONN MICROSD PUSH-PUSH SMD WITH EJECT Digikey part: 3M5607CT-ND
SV401 = SparkFun-Connectors:USB: USB Connectors USB-B-PTH is fully proven SKU : PRT-00139/CONN-08278 USB-miniB is fully proven SKU : PRT-00587 USB-A-PCB is untested. USB-A-H is throughly reviewed, but untested. Spark Fun Electronics SKU : PRT-00437 USB-B-SMT is throughly reviewed, but untested. Needs silkscreen touching up. USB-A-S has not been used/tested USB-MB-H has not been used/tested USB-MICROB has been used. CONN-09505
SW301 = SLLB510100:SLLB510100
TP1-TP3 TP5-TP8 TP10-TP18 = proxmark:TP: Test pad
U101 U201 = proxmark:FB: FERRITE BEAD
XT1 XT2 = proxmark:XTAL: CRYSTAL Citizen CS10 series 6.0mm x 3.5mm package